# EAGLE design GMO-00030 (EAGLE 5.11)
REV: 1.0; URL: https://github.com/geekammo/GMO-00030
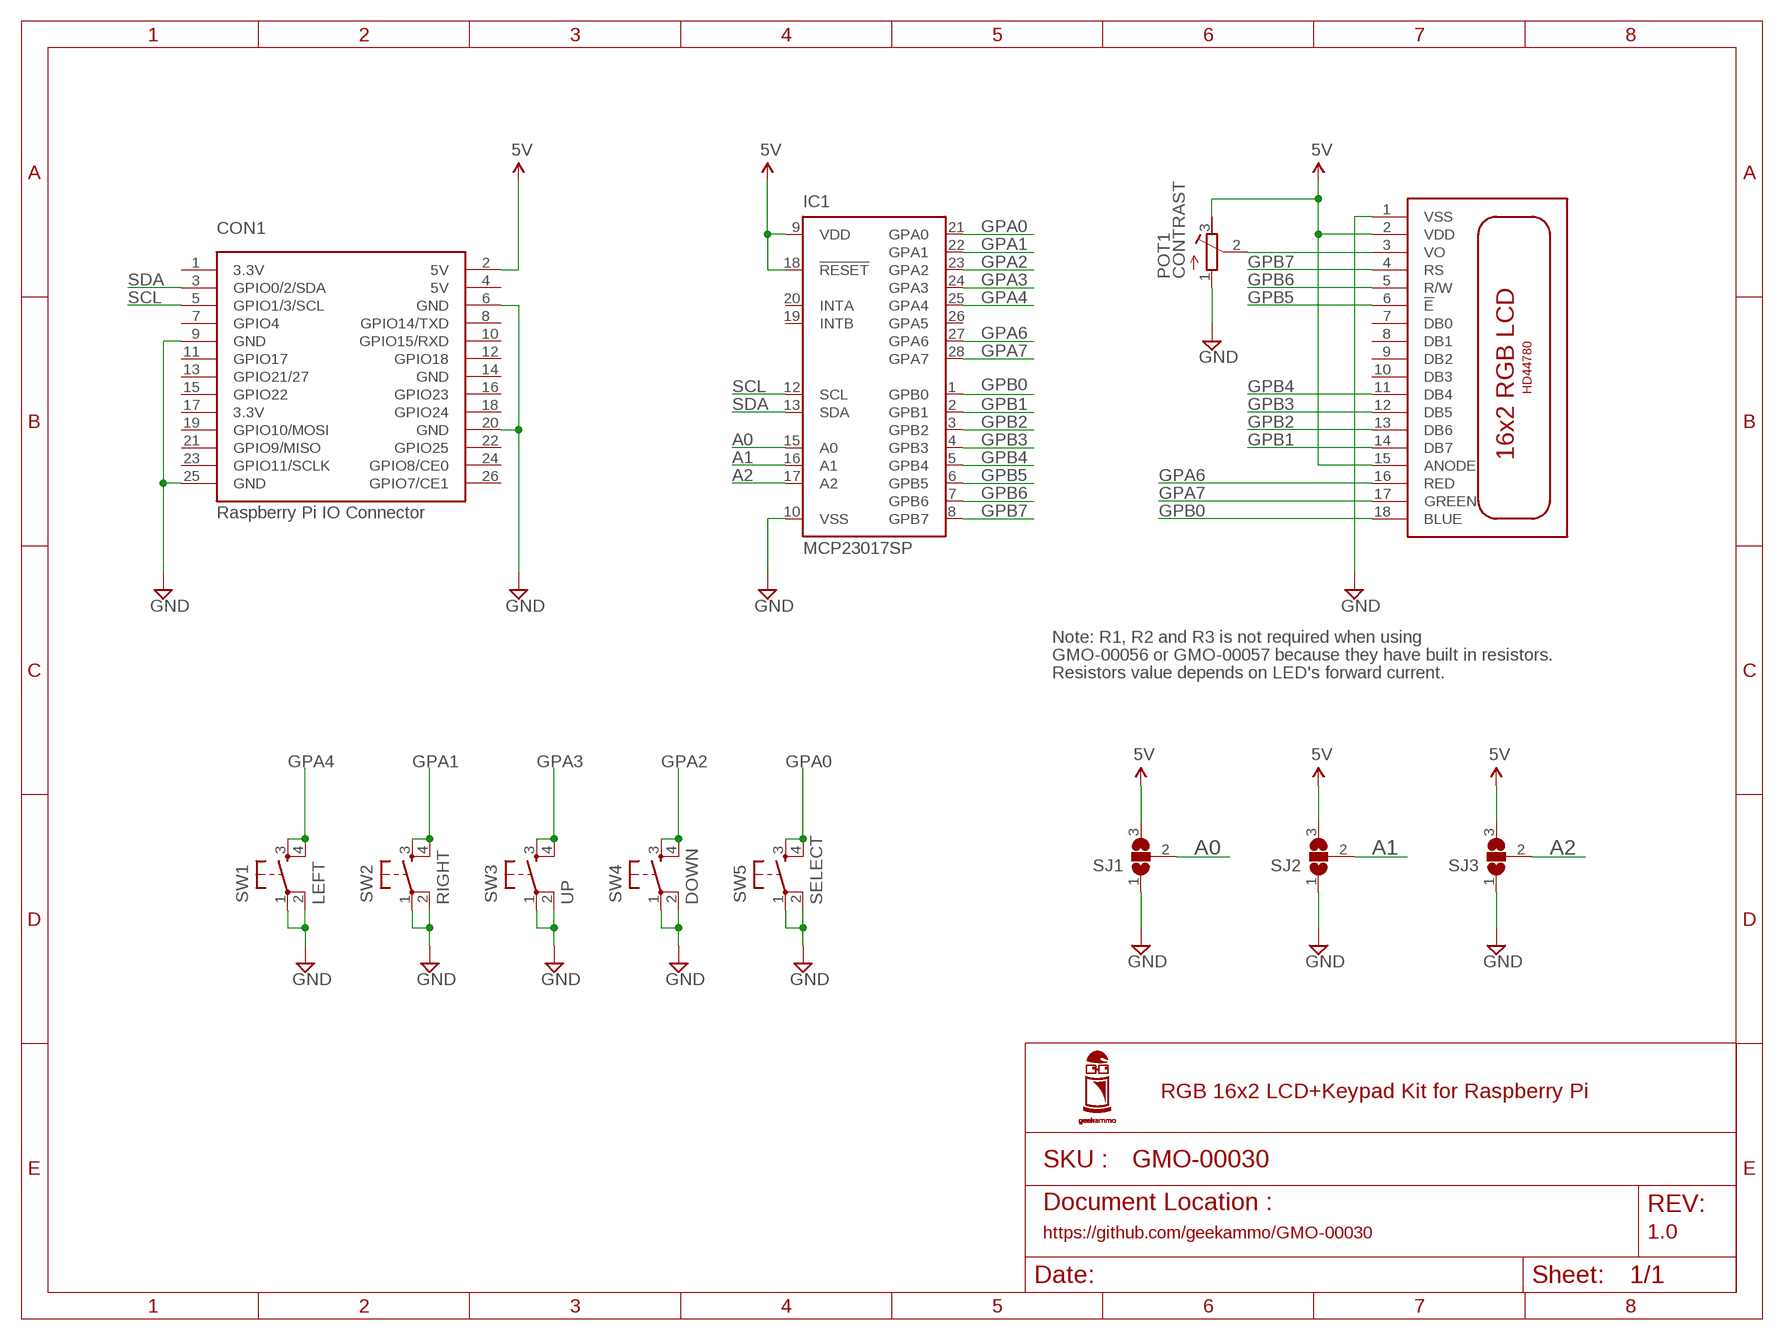
[diagram p0: schematic, sheet 1]

## Parts
CON1  Raspberry Pi IO Connector  PI-IO  [13X2-PTH]
IC1  MCP23017SP  [DIL28-3]
POT1  CONTRAST  RTRIM-3362P  [RTRIM3362P]
SJ1  SJ2W  [SJ_2]
SJ2  SJ2W  [SJ_2]
SJ3  SJ2W  [SJ_2]
SW1  LEFT  TACTILE-SWITCH-PTH  [TAC-SWITCH-PTH]
SW2  RIGHT  TACTILE-SWITCH-PTH  [TAC-SWITCH-PTH]
SW3  UP  TACTILE-SWITCH-PTH  [TAC-SWITCH-PTH]
SW4  DOWN  TACTILE-SWITCH-PTH  [TAC-SWITCH-PTH]
SW5  SELECT  TACTILE-SWITCH-PTH  [TAC-SWITCH-PTH]
U1  LCD16X2  LCD16X2-RGB  [LCD16X2-RGB]

## Nets
5V: CON1.2(5V) IC1.9(VDD) IC1.18(!RESET) POT1.3 SJ1.3 SJ2.3 SJ3.3 U1.2(VDD) U1.15(ANODE)
A0: IC1.15(A0) SJ1.2
A1: IC1.16(A1) SJ2.2
A2: IC1.17(A2) SJ3.2
GND: CON1.6(GND) CON1.9(GND) CON1.20(GND) CON1.25(GND) IC1.10(VSS) POT1.1 SJ1.1 SJ2.1 SJ3.1 SW1.1 SW1.2 SW2.1 SW2.2 SW3.1 SW3.2 SW4.1 SW4.2 SW5.1 SW5.2 U1.1(VSS)
GPA0: IC1.21(GPA0) SW5.3 SW5.4
GPA1: IC1.22(GPA1) SW2.3 SW2.4
GPA2: IC1.23(GPA2) SW4.3 SW4.4
GPA3: IC1.24(GPA3) SW3.3 SW3.4
GPA4: IC1.25(GPA4) SW1.3 SW1.4
GPA6: IC1.27(GPA6) U1.16(RED)
GPA7: IC1.28(GPA7) U1.17(GREEN)
GPB0: IC1.1(GPB0) U1.18(BLUE)
GPB1: IC1.2(GPB1) U1.14(DB7)
GPB2: IC1.3(GPB2) U1.13(DB6)
GPB3: IC1.4(GPB3) U1.12(DB5)
GPB4: IC1.5(GPB4) U1.11(DB4)
GPB5: IC1.6(GPB5) U1.6(!E!)
GPB6: IC1.7(GPB6) U1.5(R/W)
GPB7: IC1.8(GPB7) U1.4(RS)
N$1: POT1.2 U1.3(VO)
SCL: CON1.5(GPIO1/3/SCL) IC1.12(SCL)
SDA: CON1.3(GPIO0/2/SDA) IC1.13(SDA)
Unconnected: CON1.7(GPIO4) CON1.8(GPIO14/TXD) CON1.10(GPIO15/RXD) CON1.11(GPIO17) CON1.12(GPIO18) CON1.13(GPIO21/27) CON1.15(GPIO22) CON1.16(GPIO23) CON1.18(GPIO24) CON1.19(GPIO10/MOSI) CON1.21(GPIO9/MISO) CON1.22(GPIO25) CON1.23(GPIO11/SCLK) CON1.24(GPIO8/CE0) CON1.26(GPIO7/CE1) IC1.19(INTB) IC1.20(INTA) IC1.26(GPA5) U1.7(DB0) U1.8(DB1) U1.9(DB2) U1.10(DB3)

## Notes on the sheet
- Note: R1, R2 and R3 is not required when using
- GMO-00056 or GMO-00057 because they have built in resistors.
- Resistors value depends on LED's forward current.
- RGB 16x2 LCD+Keypad Kit for Raspberry Pi

## Power pins joined to a net without a drawn wire
3.3V: CON1.1(3.3V) CON1.17(3.3V)
5V: CON1.4(5V)
GND: CON1.14(GND)

## Library data of the parts
CON1 = GeekAmmo:PI-IO: Raspberry Pi IO connector
IC1 = microchip:MCP23017: http://ww1.microchip.com/downloads/en/DeviceDoc/21952a.pdf Source: http://ww1.microchip.com/downloads/en/DeviceDoc/21952a.pdf; MF: MICROCHIP; MPN: MCP23017-E/SP; OC_FARNELL: 1332088; OC_NEWARK: 31K2959
POT1 = GeekAmmo:RTRIM: BOURNS 3362 - 1/4" Square Trimpot® Trimming Potentiometer
SJ1-SJ3 = jumper:SJ2W: SMD solder JUMPER
SW1-SW5 = GeekAmmo:TACTILE-SWITCH: Tactile Switch 4 Pins, SPST NO
U1 = GeekAmmo:LCD16X2-RGB: GeekAmmo LCD 16x2 RGB GMO-00056 Negative GMO-00057 Positive

## Board
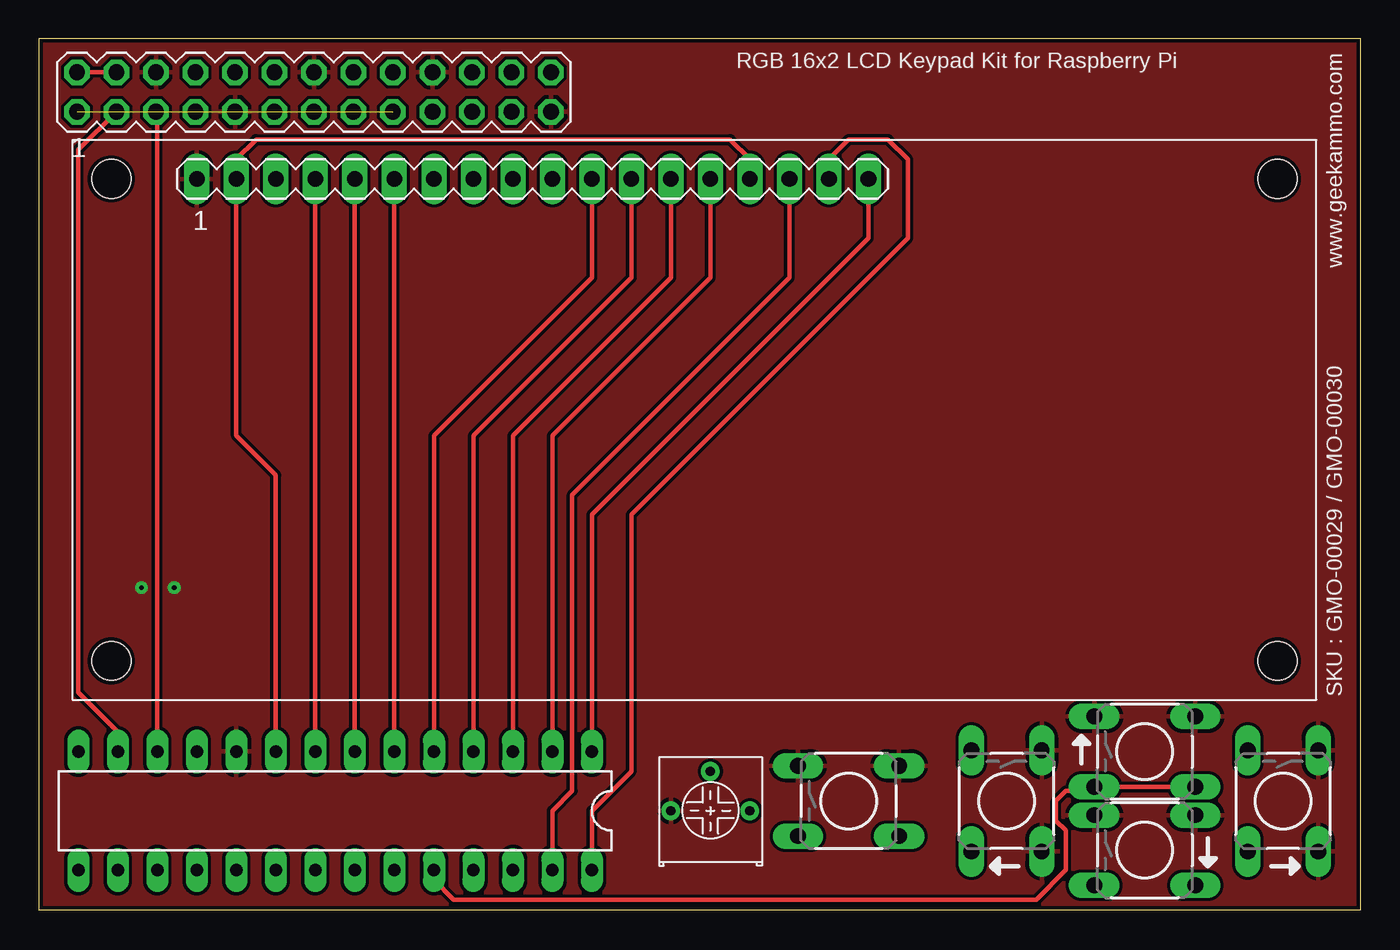
[diagram p1: board, top side]
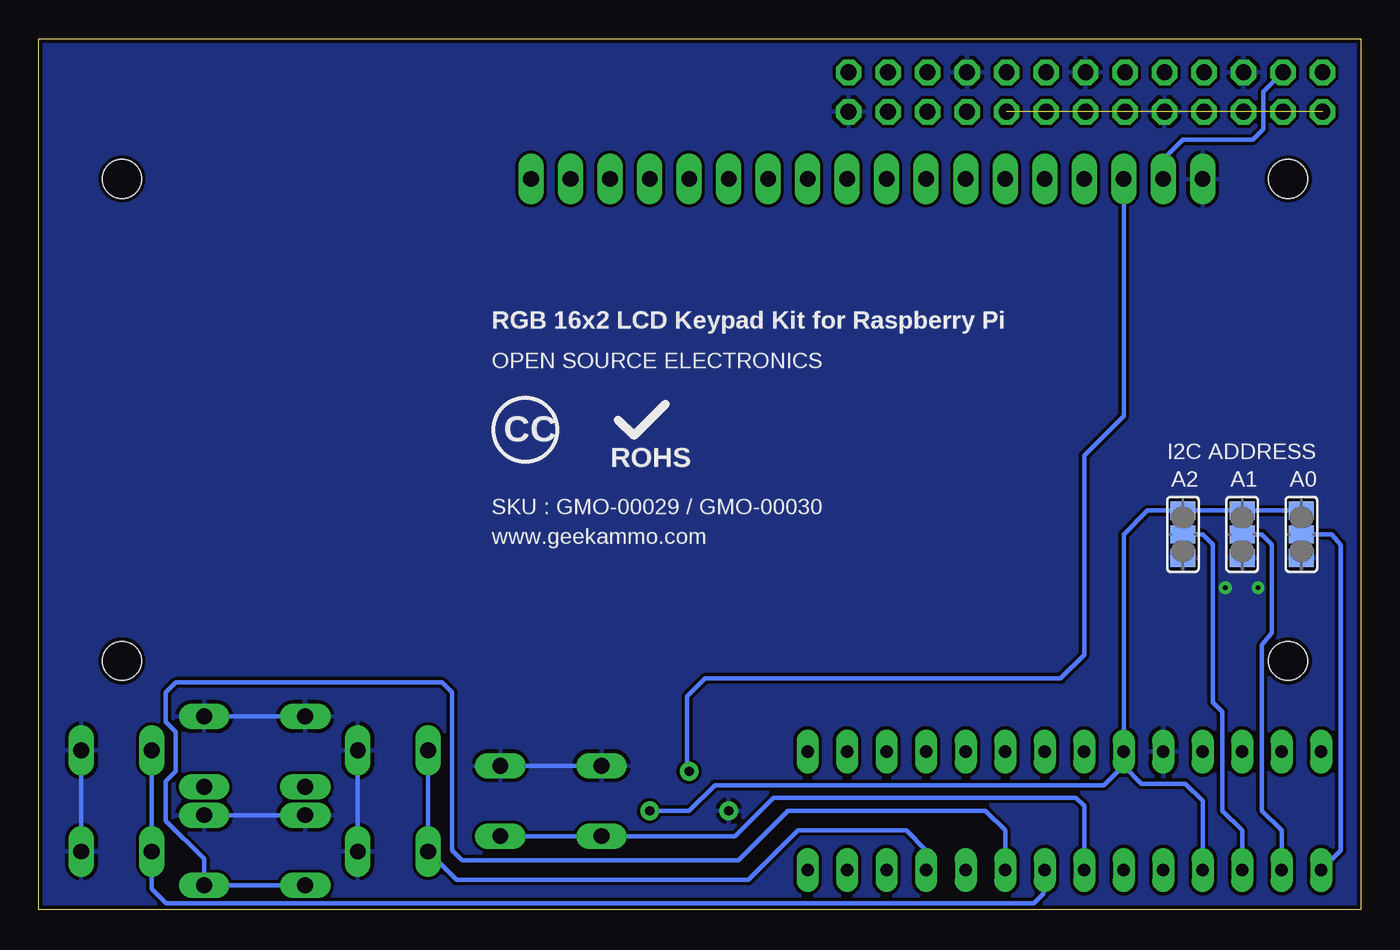
[diagram p2: board, bottom side, seen from below]

Size 85 x 56 mm. Coordinates in mm from the lower left corner, seen from the top.
Outline: 0,0 85,0 85,56 0,56 0,0
Copper layers (1*16): Top 0.035mm / dielectric 1.5mm / Bottom 0.035mm
Design rules "SparkFun": minimum track width 8mil, minimum drill 20mil, track to track 8mil, track to pad 8mil, pad to pad 8mil, via to via 8mil, smd to smd 8mil, copper to edge 10mil, drill to drill 8mil, minimum pad ring 12mil, minimum via ring 10mil, stop-mask expansion 4mil, vias tented up to drill 25mil, thermal gap 10mil

### Footprints (pad centres in the part's own frame; a part is rotated, then mirrored left to right if it is on the bottom)
13X2-PTH = drill 1.016 octagon: 1 -15.24,-1.27; 2 -15.24,1.27; 3 -12.7,-1.27; 4 -12.7,1.27; 5 -10.16,-1.27; 6 -10.16,1.27; 7 -7.62,-1.27; 8 -7.62,1.27; 9 -5.08,-1.27; 10 -5.08,1.27; 11 -2.54,-1.27; 12 -2.54,1.27; 13 0,-1.27; 14 0,1.27; 15 2.54,-1.27; 16 2.54,1.27; 17 5.08,-1.27; 18 5.08,1.27; 19 7.62,-1.27; 20 7.62,1.27; 21 10.16,-1.27; 22 10.16,1.27; 23 12.7,-1.27; 24 12.7,1.27; 25 15.24,-1.27; 26 15.24,1.27
DIL28-3 = drill 0.813 long: 1 -16.51,-3.81; 2 -13.97,-3.81; 3 -11.43,-3.81; 4 -8.89,-3.81; 5 -6.35,-3.81; 6 -3.81,-3.81; 7 -1.27,-3.81; 8 1.27,-3.81; 9 3.81,-3.81; 10 6.35,-3.81; 11 8.89,-3.81; 12 11.43,-3.81; 13 13.97,-3.81; 14 16.51,-3.81; 15 16.51,3.81; 16 13.97,3.81; 17 11.43,3.81; 18 8.89,3.81; 19 6.35,3.81; 20 3.81,3.81; 21 1.27,3.81; 22 -1.27,3.81; 23 -3.81,3.81; 24 -6.35,3.81; 25 -8.89,3.81; 26 -11.43,3.81; 27 -13.97,3.81; 28 -16.51,3.81
RTRIM3362P = drill 0.6 round: 1 -2.54,-2.54; 2 0,0; 3 2.54,-2.54
SJ_2 = smd 1.168 x 1.6: 1 -1.524,0; 2 0,0; 3 1.524,0
TAC-SWITCH-PTH = drill 1.016 pad 1.524 long: 1 -3.251,2.261; 2 3.251,2.261; 3 -3.251,-2.261; 4 3.251,-2.261
LCD16X2-RGB = drill 1.016 long: 1 0,0; 2 2.54,0; 3 5.08,0; 4 7.62,0; 5 10.16,0; 6 12.7,0; 7 15.24,0; 8 17.78,0; 9 20.32,0; 10 22.86,0; 11 25.4,0; 12 27.94,0; 13 30.48,0; 14 33.02,0; 15 35.56,0; 16 38.1,0; 17 40.64,0; 18 43.18,0 | hole 2.5: -5.5,0; -5.5,-31; 69.5,0; 69.5,-31

### Placement (x,y rotation side)
CON1  17.69,52.58 0 top
IC1  19.05,6.35 180 top
POT1  43.18,8.89 0 top
SJ1  3.81,24.13 90 bottom
SJ2  7.62,24.13 90 bottom
SJ3  11.43,24.13 90 bottom
SW1  62.23,6.99 270 top
SW2  80.01,6.99 270 top
SW3  71.12,10.16 0 top
SW4  71.12,3.81 0 top
SW5  52.07,6.99 0 top
U1  10.16,46.99 0 top

### Tracks (layer width: path | path; a pad name or v marks a point on that pad's centre or on a via)
3.3V  (1 unrouted)
5V
  Top 0.305: IC1.9 15.24,27.94 12.7,30.48 U1.2 12.7,48.26 13.97,49.53 44.45,49.53 45.72,48.26 U1.15 | CON1.4 CON1.2
  Bottom 0.305: SJ1.3 SJ2.3 SJ3.3 13.72,25.65 15.24,24.13 IC1.9 | IC1.9 15.24,9.26 16.5,8 41.53,8 43.18,6.35 POT1.3 | U1.2 12.7,48.26 11.43,49.53 6.92,49.53 6.25,50.2 6.25,52.59 CON1.4 | IC1.9 15.24,9.24 14.1,8.1 11.28,8.1 10.16,6.99 IC1.18
A0
  Bottom 0.305: IC1.15 1.27,3.81 1.27,23.46 1.84,24.13 SJ1.2
A1
  Bottom 0.305: IC1.16 5.08,5.08 6.35,6.35 6.35,17.02 5.71,17.78 5.71,23.5 6.35,24.13 SJ2.2
A2
  Bottom 0.305: IC1.17 7.62,5.08 8.89,6.35 8.89,12.7 9.5,13.31 9.5,23.5 9.53,23.5 10.16,24.13 SJ3.2
GND  (via drill 0.3)
  Bottom 0.305: SW2.2 SW2.1 | SW3.1 SW3.2 | SW4.1 SW4.2 | SW1.2 SW1.1 | SW5.1 SW5.2
  other vias: 6.6,20.7 8.7,20.7
  pour Bottom: -1.27,57.15 -1.27,-1.27 87.63,-1.27 87.63,57.15
  pour Top: -1.27,57.15 -1.27,-1.27 86.36,-1.27 86.36,57.15
GPA0
  Bottom 0.305: IC1.21 17.78,6.68 18.3,7.2 37.77,7.2 40.24,4.72 SW5.3 SW5.4
GPA1
  Bottom 0.305: SW2.3 SW2.4 77.75,1.35 76.8,0.4 21,0.4 20.4,1 20.4,2.46 IC1.22
GPA2
  Bottom 0.305: IC1.23 22.86,5.08 24.13,6.35 36.83,6.35 40.01,3.17 57.78,3.17 58.42,3.81 58.42,13.97 59.05,14.61 76.2,14.61 76.83,13.97 76.83,12.06 76.2,11.43 76.2,8.89 76.83,8.26 76.83,5.71 74.37,3.25 SW4.4 SW4.3
GPA3
  Top 0.305: IC1.24 25.4,1.91 26.67,0.64 64.14,0.64 66.04,2.54 66.04,5.08 65.41,5.71 65.41,6.99 66.04,7.62 67.59,7.62 SW3.3 SW3.4
GPA4
  Bottom 0.305: SW1.3 SW1.4 58.14,1.91 39.37,1.91 36.2,5.08 29.21,5.08 27.94,3.81 IC1.25
GPA6
  Top 0.305: IC1.27 33.02,6.35 34.29,7.62 34.29,26.67 48.26,40.64 U1.16
GPA7
  Top 0.305: IC1.28 35.56,6.35 38.1,8.89 38.1,25.4 55.88,43.18 55.88,48.26 54.61,49.53 52.07,49.53 50.8,48.26 U1.17
GPB0
  Top 0.305: IC1.1 35.56,25.4 53.34,43.18 U1.18
GPB1
  Top 0.305: IC1.2 33.02,30.48 43.18,40.64 U1.14
GPB2
  Top 0.305: IC1.3 30.48,30.48 40.64,40.64 U1.13
GPB3
  Top 0.305: IC1.4 27.94,30.48 38.1,40.64 U1.12
GPB4
  Top 0.305: IC1.5 25.4,30.48 35.56,40.64 U1.11
GPB5
  Top 0.305: IC1.6 U1.6
GPB6
  Top 0.305: IC1.7 U1.5
GPB7
  Top 0.305: IC1.8 U1.4
N$1
  Bottom 0.305: U1.3 15.24,31.75 17.78,29.21 17.78,16.38 19.3,14.86 42.16,14.86 43.31,13.72 43.31,9.02 POT1.2
SCL
  Top 0.305: IC1.12 7.62,51.22 CON1.5
SDA
  Top 0.305: IC1.13 5.08,11.43 2.54,13.97 2.54,48.86 CON1.3

### Text on the board
tPlace: RGB 16x2 LCD Keypad Kit for Raspberry Pi | www.geekammo.com | SKU : GMO-00029 / GMO-00030
bPlace: RGB 16x2 LCD Keypad Kit for Raspberry Pi | OPEN SOURCE ELECTRONICS | CC | I2C ADDRESS | ROHS | A0 | A1 | A2 | SKU : GMO-00029 / GMO-00030 | www.geekammo.com